# EAGLE design mega16_spg5VonlyV2 (EAGLE 7.3.0)
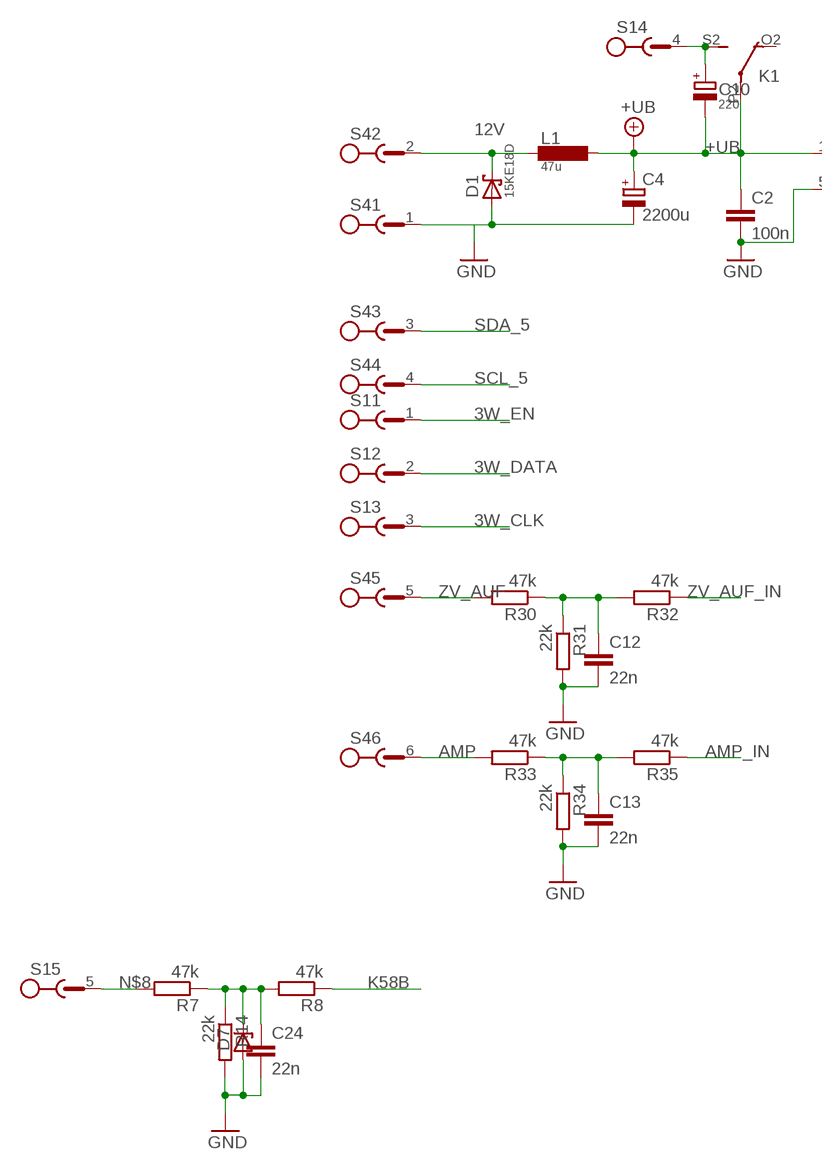
[diagram p0: schematic, sheet 1, part 1 of 2]
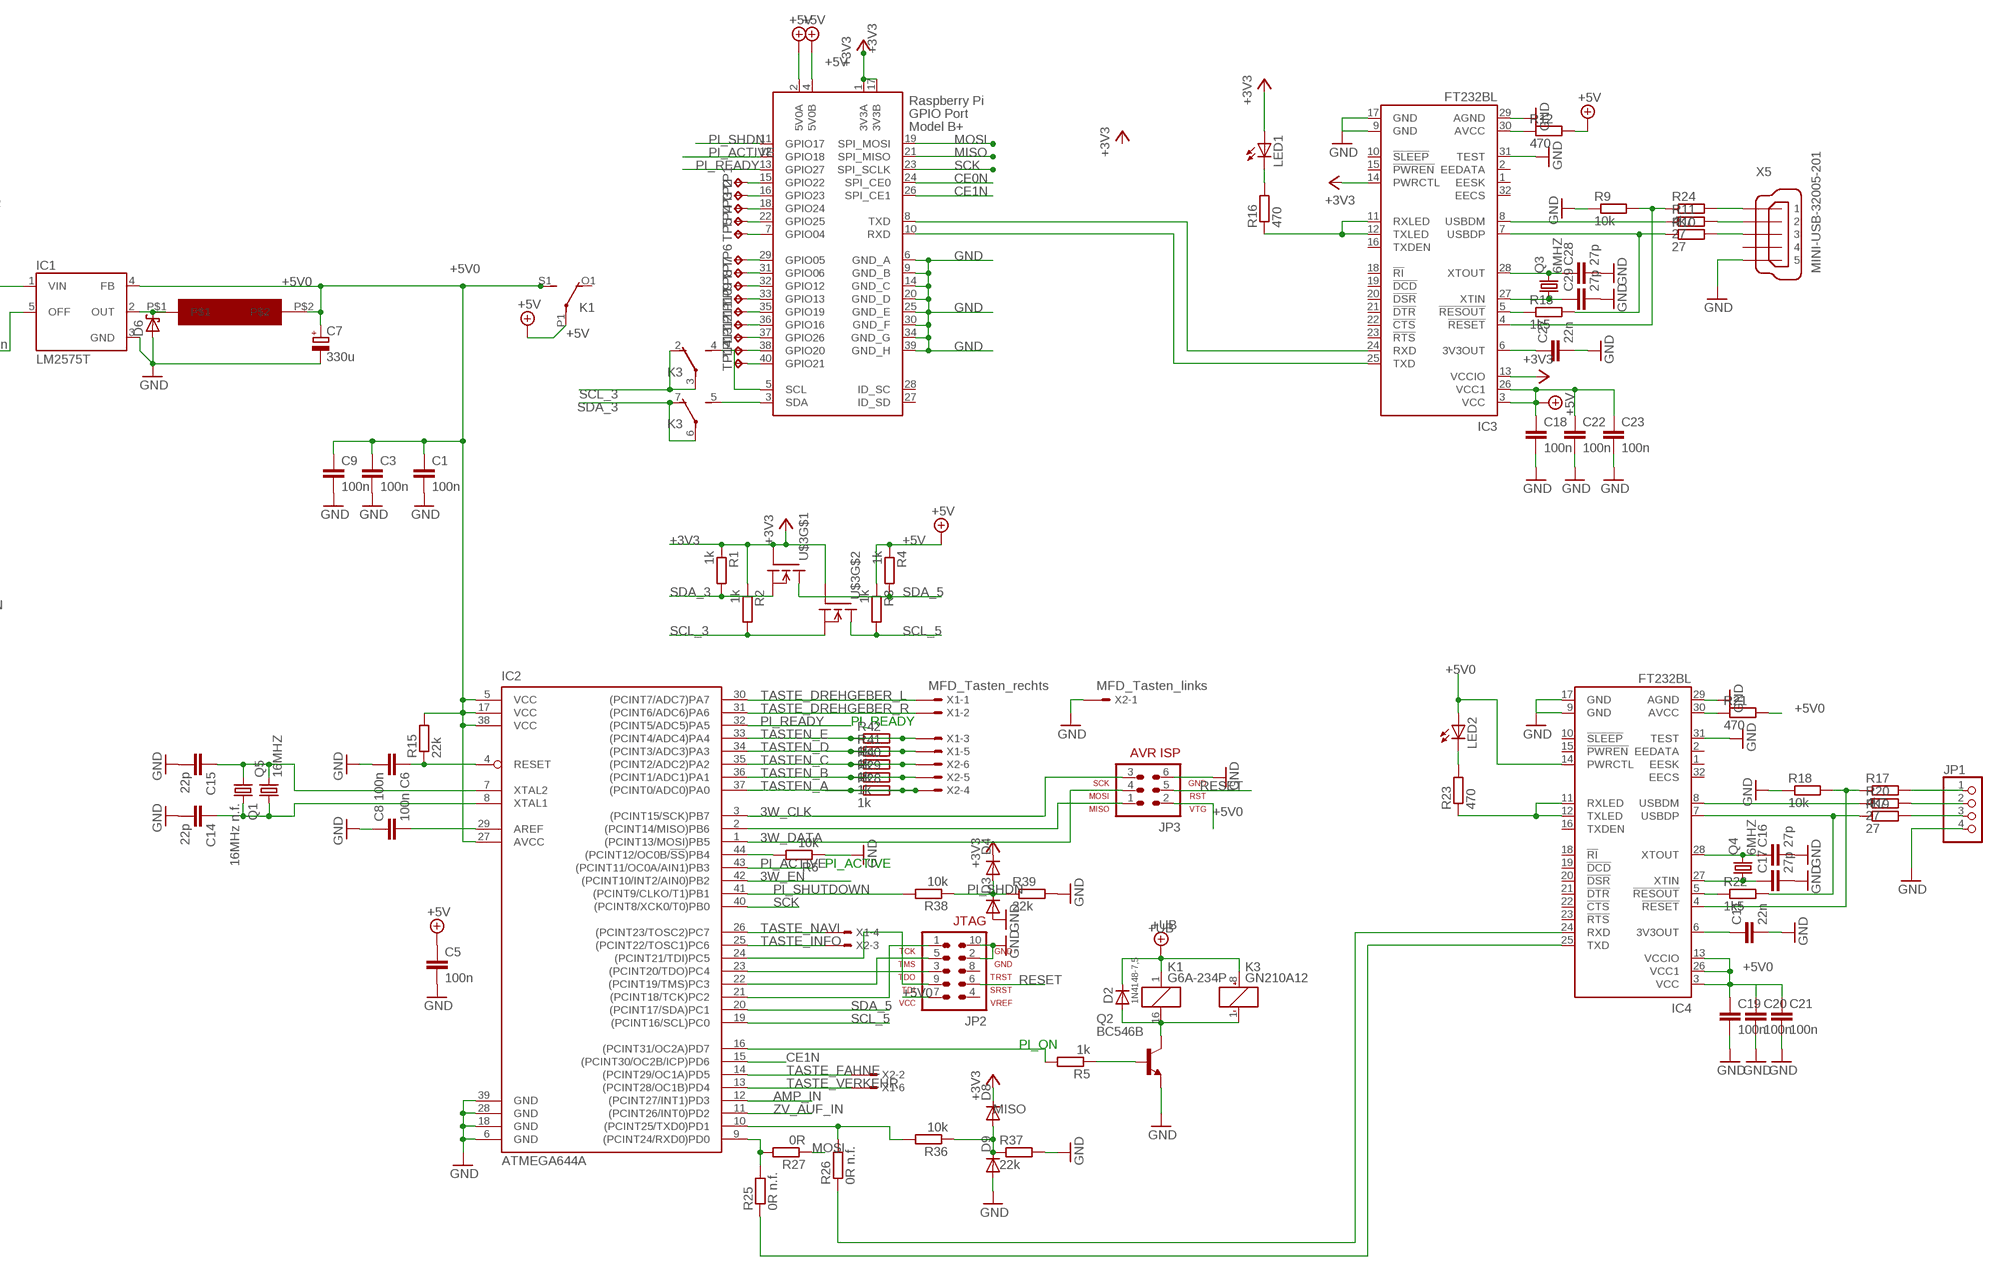
[diagram p1: schematic, sheet 1, part 2 of 2]

## Parts
C1  100n  C-EUC1206  [C1206]
C2  100n  C-EUC1206  [C1206]
C3  100n  C-EUC1206  [C1206]
C4  2200u  CPOL-EUE5-10.5  [E5-10,5]
C5  100n  C-EUC1206  [C1206]
C6  100n  C-EUC1206  [C1206]
C7  330u  CPOL-EUE5-10.5  [E5-10,5]
C8  100n  C-EUC1206  [C1206]
C9  100n  C-EUC1206  [C1206]
C10  220  C_POL_2.5-5  [E2.5-5]
C11  22n  C-EUC1206  [C1206]
C12  22n  C-EUC1206  [C1206]
C13  22n  C-EUC1206  [C1206]
C14  22p  C-EUC1206  [C1206]
C15  22p  C-EUC1206  [C1206]
C16  27p  C-EUC1206  [C1206]
C17  27p  C-EUC1206  [C1206]
C18  100n  C-EUC1206  [C1206]
C19  100n  C-EUC1206  [C1206]
C20  100n  C-EUC1206  [C1206]
C21  100n  C-EUC1206  [C1206]
C22  100n  C-EUC1206  [C1206]
C23  100n  C-EUC1206  [C1206]
C24  22n  C-EUC1206  [C1206]
C27  22n  C-EUC1206  [C1206]
C28  27p  C-EUC1206  [C1206]
C29  27p  C-EUC1206  [C1206]
D1  15KE18D  15KEXXD  [DO201T15]
D2  1N4148-7,5  [DO35-7,5]
D3  DIODE-MICROMELF-W  [MICROMELF-W]
D4  DIODE-MICROMELF-W  [MICROMELF-W]
D6  SCHOTTKY-DIODEF126Z12  [F126Z12]
D7  ZPP-7.5  [DO35-7,5]
D8  DIODE-MICROMELF-W  [MICROMELF-W]
D9  DIODE-MICROMELF-W  [MICROMELF-W]
IC1  LM2575T  [TO220-5]
IC2  ATMEGA644A  [TQFP44]
IC3  FT232BL  [LQFP32-7X7]
IC4  FT232BL  [LQFP32-7X7]
JP1  PINHD-1X4_2.54  [1X04]
JP2  AVR-JTAG-10  [AVR-JTAG-10]
JP3  AVR-ISP-6  [AVR-ISP-6]
K1  G6A-234P  [G6A-234P]
K3  GN210A12  [GN-A]
L1  47u  L-MESC  [MESC26]
LED1  LEDP-LCC-2  [P-LCC-2]
LED2  LEDP-LCC-2  [P-LCC-2]
Q1  16MHz n.f.  CRYSTALHC49S  [HC49/S]
Q2  BC546B  [TO92-EBC]
Q3  6MHZ  CRYSTALCTS406  [CTS406]
Q4  6MHZ  CRYSTALCTS406  [CTS406]
Q5  16MHZ  CRYSTALCTS406  [CTS406]
R1  1k  R-EU_M1206  [M1206]
R2  1k  R-EU_M1206  [M1206]
R3  1k  R-EU_M1206  [M1206]
R4  1k  R-EU_M1206  [M1206]
R5  1k  R-EU_M1206  [M1206]
R6  10k  R-EU_M1206  [M1206]
R7  47k  R-EU_M1206  [M1206]
R8  47k  R-EU_M1206  [M1206]
R9  10k  R-EU_M1206  [M1206]
R10  27  R-EU_M1206  [M1206]
R11  27  R-EU_M1206  [M1206]
R12  470  R-EU_M1206  [M1206]
R13  1k5  R-EU_M1206  [M1206]
R14  22k  R-EU_M1206  [M1206]
R15  22k  R-EU_M1206  [M1206]
R16  470  R-EU_M1206  [M1206]
R17  4k7  R-EU_M1206  [M1206]
R18  10k  R-EU_M1206  [M1206]
R19  27  R-EU_M1206  [M1206]
R20  27  R-EU_M1206  [M1206]
R21  470  R-EU_M1206  [M1206]
R22  1k5  R-EU_M1206  [M1206]
R23  470  R-EU_M1206  [M1206]
R24  4k7  R-EU_M1206  [M1206]
R25  0R n.f.  R-EU_M1206  [M1206]
R26  0R n.f.  R-EU_M1206  [M1206]
R27  0R  R-EU_M1206  [M1206]
R28  1k  R-EU_M1206  [M1206]
R29  1k  R-EU_M1206  [M1206]
R30  47k  R-EU_M1206  [M1206]
R31  22k  R-EU_M1206  [M1206]
R32  47k  R-EU_M1206  [M1206]
R33  47k  R-EU_M1206  [M1206]
R34  22k  R-EU_M1206  [M1206]
R35  47k  R-EU_M1206  [M1206]
R36  10k  R-EU_M1206  [M1206]
R37  22k  R-EU_M1206  [M1206]
R38  10k  R-EU_M1206  [M1206]
R39  22k  R-EU_R1206  [R1206]
R40  1k  R-EU_M1206  [M1206]
R41  1k  R-EU_M1206  [M1206]
R42  1k  R-EU_M1206  [M1206]
S1  CON-RIA-183-05  [RIA-183-05]
S4  CON-RIA-183-06  [RIA-183-06]
TP1  TPPAD1-13  [P1-13]
TP2  TPPAD1-13  [P1-13]
TP3  TPPAD1-13  [P1-13]
TP4  TPPAD1-13  [P1-13]
TP5  TPPAD1-13  [P1-13]
TP6  TPPAD1-13  [P1-13]
TP7  TPPAD1-13  [P1-13]
TP8  TPPAD1-13  [P1-13]
TP9  TPPAD1-13  [P1-13]
TP10  TPPAD1-13  [P1-13]
TP11  TPPAD1-13  [P1-13]
TP12  TPPAD1-13  [P1-13]
TP13  TPPAD1-13  [P1-13]
TP14  TPPAD1-13  [P1-13]
U$1  PISR  [PISR]
U$3  IRF7103  [SO-8]
X1  MFD_Tasten_rechts  057-006-1  [057-006-1]
X2  MFD_Tasten_links  057-006-1  [057-006-1]
X3  RASPI_GPIO_B+#_PIN  [RASPI_GPIO_B+_PIN]
X5  MINI-USB-32005-201  [32005-201]

## Nets
3W_CLK: IC2.3((PCINT15/SCK)PB7) JP3.3 S1.3
3W_DATA: IC2.1((PCINT13/MOSI)PB5) JP3.4 S1.2
3W_EN: IC2.42((PCINT10/INT2/AIN0)PB2) S1.1
12V: D1.C L1.1 S4.2
+3V3: D4.C D8.C IC3.13(VCCIO) IC3.14(PWRCTL) LED1.A R1.1 R2.1 U$3.2(G) U$3.4(G) X3.1(3V3A) X3.17(3V3B)
+5V: C5.1 C18.1 C22.1 C23.1 IC3.3(VCC) IC3.26(VCC1) K1.P1(2:P) R3.1 R4.1 R12.2 X3.2(5V0A) X3.4(5V0B)
+5V0: C1.1 C3.1 C7.+ C9.1 C19.1 C20.1 C21.1 IC1.4(FB) IC2.5(VCC) IC2.17(VCC) IC2.27(AVCC) IC2.38(VCC) IC4.3(VCC) IC4.13(VCCIO) IC4.14(PWRCTL) IC4.26(VCC1) JP2.7 JP3.2 K1.S1(2:S) LED2.A R15.2 R21.2 U$1.P$2
+UB: C2.1 C4.+ C10.- D2.C IC1.1(VIN) K1.1 K1.P2(3:P) K3.8(R:+) L1.2
AMP: R33.2 S4.6
AMP_IN: IC2.12((PCINT27/INT1)PD3) R35.1
CE0N: X3.24(SPI_CE0)
CE1N: IC2.15((PCINT30/OC2B/ICP)PD6) X3.26(SPI_CE1)
GND: C1.2 C2.2 C3.2 C4.- C5.2 C6.2 C7.- C8.1 C9.2 C11.2 C12.2 C13.2 C14.2 C15.2 C16.2 C17.2 C18.2 C19.2 C20.2 C21.2 C22.2 C23.2 C24.2 C27.2 C28.2 C29.2 D1.A D3.A D6.A D7.A D9.A IC1.3(GND) IC1.5(OFF) IC2.6(GND) IC2.18(GND) IC2.28(GND) IC2.39(GND) IC3.9(GND) IC3.17(GND) IC3.29(AGND) IC3.31(TEST) IC4.9(GND) IC4.17(GND) IC4.29(AGND) IC4.31(TEST) JP1.4 JP2.2 JP2.10 JP3.6 Q2.E R6.1 R9.1 R14.2 R18.1 R31.2 R34.2 R37.2 R39.2 S4.1 X2.1 X3.6(GND_A) X3.9(GND_B) X3.14(GND_C) X3.20(GND_D) X3.25(GND_E) X3.30(GND_F) X3.34(GND_G) X3.39(GND_H) X5.5
K58B: R8.1
MISO: D8.A D9.C R36.1 R37.1 X3.21(SPI_MISO)
MOSI: R27.1 X3.19(SPI_MOSI)
N$1: C10.+ K1.S2(3:S) S1.4
N$2: D2.A K1.16 K3.1(R:-) Q2.C
N$3: IC3.24(RXD) X3.8(TXD)
N$4: C24.1 D7.C R7.1 R8.2 R14.1
N$5: D6.C IC1.2(OUT) U$1.P$1
N$6: C15.1 IC2.7(XTAL2) Q1.1 Q5.3
N$7: C8.2 IC2.29(AREF)
N$8: R7.2 S1.5
N$9: IC3.25(TXD) X3.10(RXD)
N$10: IC2.10((PCINT25/TXD0)PD1) R26.2 R36.2
N$11: IC2.21((PCINT18/TCK)PC2) JP2.1
N$12: IC2.22((PCINT19/TMS)PC3) JP2.5
N$13: Q2.B R5.1
N$14: IC2.44((PCINT12/OC0B/!SS!)PB4) R6.2
N$15: IC2.23((PCINT20/TDO)PC4) JP2.3
N$16: IC2.16((PCINT31/OC2A)PD7) R5.2
N$17: IC2.24((PCINT21/TDI)PC5) JP2.9
N$18: C11.1 IC4.6(3V3OUT)
N$19: IC3.11(RXLED) IC3.12(TXLED) R16.1
N$20: IC2.2((PCINT14/MISO)PB6) JP3.1
N$21: LED1.C R16.2
N$22: IC4.7(USBDP) R19.1 R22.2
N$23: IC4.8(USBDM) R20.1
N$24: JP1.1 R17.2
N$25: IC4.4(!RESET) R17.1 R18.2
N$26: JP1.3 R19.2
N$27: JP1.2 R20.2
N$28: IC4.30(AVCC) R21.1
N$29: IC4.5(!RESOUT) R22.1
N$30: C17.1 IC4.27(XTIN) Q4.1
N$31: C16.1 IC4.28(XTOUT) Q4.3
N$32: IC4.24(RXD) R26.1
N$33: IC4.25(TXD) R25.1
N$34: IC4.11(RXLED) IC4.12(TXLED) R23.1
N$35: LED2.C R23.2
N$36: IC2.9((PCINT24/RXD0)PD0) R25.2 R27.2
N$37: K3.5(T:S) X3.3(SDA)
N$38: TP14.1(TP) X3.40(GPIO21)
N$39: K3.4(S:S) X3.5(SCL)
N$40: TP13.1(TP) X3.38(GPIO20)
N$41: TP12.1(TP) X3.37(GPIO26)
N$42: TP11.1(TP) X3.36(GPIO16)
N$43: TP10.1(TP) X3.35(GPIO19)
N$44: TP9.1(TP) X3.33(GPIO13)
N$45: C14.1 IC2.8(XTAL1) Q1.2 Q5.1
N$46: TP8.1(TP) X3.32(GPIO12)
N$47: TP7.1(TP) X3.31(GPIO06)
N$48: TP6.1(TP) X3.29(GPIO05)
N$49: TP1.1(TP) X3.15(GPIO22)
N$50: C12.1 R30.1 R31.1 R32.2
N$51: TP2.1(TP) X3.16(GPIO23)
N$52: C13.1 R33.1 R34.1 R35.2
N$53: TP3.1(TP) X3.18(GPIO24)
N$54: R10.2 X5.3
N$55: R11.2 X5.2
N$56: IC3.30(AVCC) R12.1
N$57: IC3.5(!RESOUT) R13.1
N$58: C27.1 IC3.6(3V3OUT)
N$59: IC3.7(USBDP) R10.1 R13.2
N$60: IC3.8(USBDM) R11.1
N$61: R24.2 X5.1
N$62: IC3.4(!RESET) R9.2 R24.1
N$63: C29.1 IC3.27(XTIN) Q3.1
N$64: C28.1 IC3.28(XTOUT) Q3.3
N$65: TP4.1(TP) X3.22(GPIO25)
N$66: TP5.1(TP) X3.7(GPIO04)
PI_ACTIVE: IC2.43((PCINT11/OC0A/AIN1)PB3) X3.12(GPIO18)
PI_READY: IC2.32((PCINT5/ADC5)PA5) X3.13(GPIO27)
PI_SHDN: D3.C D4.A R38.1 R39.1 X3.11(GPIO17)
PI_SHUTDOWN: IC2.41((PCINT9/CLKO/T1)PB1) R38.2
RESET: C6.1 IC2.4(RESET) JP2.6 JP3.5 R15.1
SCK: IC2.40((PCINT8/XCK0/T0)PB0) X3.23(SPI_SCLK)
SCL_3: K3.2(S:O) K3.3(S:P) R2.2 U$3.3(S)
SCL_5: IC2.19((PCINT16/SCL)PC0) R3.2 S4.4 U$3.5(D1) U$3.6(D)
SDA_3: K3.6(T:P) K3.7(T:O) R1.2 U$3.1(S)
SDA_5: IC2.20((PCINT17/SDA)PC1) R4.2 S4.3 U$3.7(D) U$3.8(D1)
TASTE_DREHGEBER_L: IC2.30((PCINT7/ADC7)PA7) X1.1
TASTE_DREHGEBER_R: IC2.31((PCINT6/ADC6)PA6) X1.2
TASTE_FAHNE: IC2.14((PCINT29/OC1A)PD5) X2.2
TASTE_INFO: IC2.25((PCINT22/TOSC1)PC6) X2.3
TASTE_NAVI: IC2.26((PCINT23/TOSC2)PC7) X1.4
TASTE_VERKEHR: IC2.13((PCINT28/OC1B)PD4) X1.6
TASTEN_A: IC2.37((PCINT0/ADC0)PA0) R28.1 R28.2 X2.4
TASTEN_B: IC2.36((PCINT1/ADC1)PA1) R29.1 R29.2 X2.5
TASTEN_C: IC2.35((PCINT2/ADC2)PA2) R40.1 R40.2 X2.6
TASTEN_D: IC2.34((PCINT3/ADC3)PA3) R41.1 R41.2 X1.5
TASTEN_E: IC2.33((PCINT4/ADC4)PA4) R42.1 R42.2 X1.3
ZV_AUF: R30.2 S4.5
ZV_AUF_IN: IC2.11((PCINT26/INT0)PD2) R32.1
Unconnected: IC3.1(EESK) IC3.2(EEDATA) IC3.10(!SLEEP) IC3.15(!PWREN) IC3.16(TXDEN) IC3.18(!RI) IC3.19(!DCD) IC3.20(!DSR) IC3.21(!DTR) IC3.22(!CTS) IC3.23(!RTS) IC3.32(EECS) IC4.1(EESK) IC4.2(EEDATA) IC4.10(!SLEEP) IC4.15(!PWREN) IC4.16(TXDEN) IC4.18(!RI) IC4.19(!DCD) IC4.20(!DSR) IC4.21(!DTR) IC4.22(!CTS) IC4.23(!RTS) IC4.32(EECS) JP2.4 JP2.8 K1.O1(2:O) K1.O2(3:O) X3.27(ID_SD) X3.28(ID_SC) X5.4

## Notes on the sheet
- PI_READY
- PI_ACTIVE
- PI_ON

## Library data of the parts
C1-C3 C5 C6 C8 C9 C11-C24 C27-C29 = rcl:C-EU: CAPACITOR, European symbol
C4 C7 = rcl:CPOL-EU: POLARIZED CAPACITOR, European symbol
C10 = 0_eigene:C_POL_2.5-5
D1 = 0_eigene:15KEXXD: DIODE
D2 = 0_eigene:1N4148-7,5
D3 D4 D8 D9 = diode:DIODE-: DIODE
D6 = diode:SCHOTTKY-DIODE: Schottky Diode
D7 = 0_eigene:ZPP-7.5
IC1 = v-reg-3:LM2575: National Semiconductor <http://www.national.com> 1.0A "Simple Switcher"(c) 52kHz, Vout 1.23-37V (HV: 57V), Vin 40V (HV: 60V), 50µA standby current
IC2 = atmel:ATMEGA644: 8-bit Microcontroller with 64K Bytes In-System Programmable Flash Source: http://www.atmel.com/dyn/resources/prod_documents/doc2593.pdf
IC3 IC4 = ftdichip:FT232B: USB to serial UART interface Source: DS_FT232BL_BQ.pdf; MF: FARNELL; MPN: FT232BL/TR; OC_FARNELL: unknown; OC_NEWARK: 38K1551
JP1 = pinhead:PINHD-1X4: PIN HEADER
JP2 = avr-5:AVR-JTAG-10: AVR JTAG Debug/Programming Header
JP3 = avr-5:AVR-ISP-6: AVR ISP-6 Serial Programming Header
K1 = relay:G6A-234P: RELAY 2 x switch, 0.3 A/125 V AC, 1 A/30 V DC, Omron
K3 = relay:GN?*: ULTRA-SMALL PACKAGE SLIM POLARIZED RELAY NAiS Source: http://www.mew-europe.com/.. en_ds_61007_0000.pdf
L1 = 0_eigene:L-MESC
LED1 LED2 = led:LED: LED OSRAM: - CHIPLED LG R971, LG N971, LY N971, LG Q971, LY Q971, LO R971, LY R971 LH N974, LH R974 LS Q976, LO Q976, LY Q976 LO Q996 - Hyper CHIPLED LW Q18S LB Q993, LB Q99A, LB R99A - SideLED LS A670, LO A670, LY A670, LG A670, LP A670 LB A673, LV A673, LT A673, LW A673 LH A674 LY A675 LS A676, LA A676, LO A676, LY A676, LW A676 LS A679, LY A679, LG A679 - Hyper Micro SIDELED® LS Y876, LA Y876, LO Y876, LY Y876 LT Y87S - SmartLED LW L88C, LW L88S LB L89C, LB L89S, LG L890 LS L89K, LO L89K, LY L89K LS L896, LA L896, LO L896, LY L896 - TOPLED LS T670, LO T670, LY T670, LG T670, LP T670 LSG T670, LSP T670, LSY T670, LOP T670, LYG T670 LG T671, LOG T671, LSG T671 LB T673, LV T673, LT T673, LW T673 LH T674 LS T676, LA T676, LO T676, LY T676, LB T676, LH T676, LSB T676, LW T676 LB T67C, LV T67C, LT T67C, LS T67K, LO T67K, LY T67K, LW E67C LS E67B, LA E67B, LO E67B, LY E67B, LB E67C, LV E67C, LT E67C LW T67C LS T679, LY T679, LG T679 LS T770, LO T770, LY T770, LG T770, LP T770 LB T773, LV T773, LT T773, LW T773 LH T774 LS E675, LA E675, LY E675, LS T675 LS T776, LA T776, LO T776, LY T776, LB T776 LHGB T686 LT T68C, LB T68C - Hyper Mini TOPLED® LB M676 - Mini TOPLED Santana® LG M470 LS M47K, LO M47K, LY M47K Source: http://www.osram.convergy.de LUXEON: - LUMILED® LXK2-PW12-R00, LXK2-PW12-S00, LXK2-PW14-U00, LXK2-PW14-V00 LXK2-PM12-R00, LXK2-PM12-S00, LXK2-PM14-U00 LXK2-PE12-Q00, LXK2-PE12-R00, LXK2-PE12-S00, LXK2-PE14-T00, LXK2-PE14-U00 LXK2-PB12-K00, LXK2-PB12-L00, LXK2-PB12-M00, LXK2-PB14-N00, LXK2-PB14-P00, LXK2-PB14-Q00 LXK2-PR12-L00, LXK2-PR12-M00, LXK2-PR14-Q00, LXK2-PR14-R00 LXK2-PD12-Q00, LXK2-PD12-R00, LXK2-PD12-S00 LXK2-PH12-R00, LXK2-PH12-S00 LXK2-PL12-P00, LXK2-PL12-Q00, LXK2-PL12-R00 Source: www.luxeon.com KINGBRIGHT: KA-3528ASYC Source: www.kingbright.com
Q1 Q3-Q5 = crystal:CRYSTAL: CRYSTAL
Q2 = transistor-npn:BC546*: NPN Transistor
R1-R42 = rcl:R-EU_: RESISTOR, European symbol
S1 = 0_eigene:CON-RIA-183-05
S4 = 0_eigene:CON-RIA-183-06
TP1-TP14 = testpad:TP: Test pad
U$1 = inductor_FASTRON:PISR
U$3 = transistor-fet+irf7201:IRF7103
X1 X2 = con-panduit:057-006-: CONNECTOR 6-pin series 057 contact pc board low profile headers
X3 = raspberrypi_bastelstube_v13:RASPI_GPIO_B+#: 2x20 header connector, all pins connected
X5 = con-cypressindustries:MINI-USB-: MINI USB-B Conector Source: www.cypressindustries.com

## Board
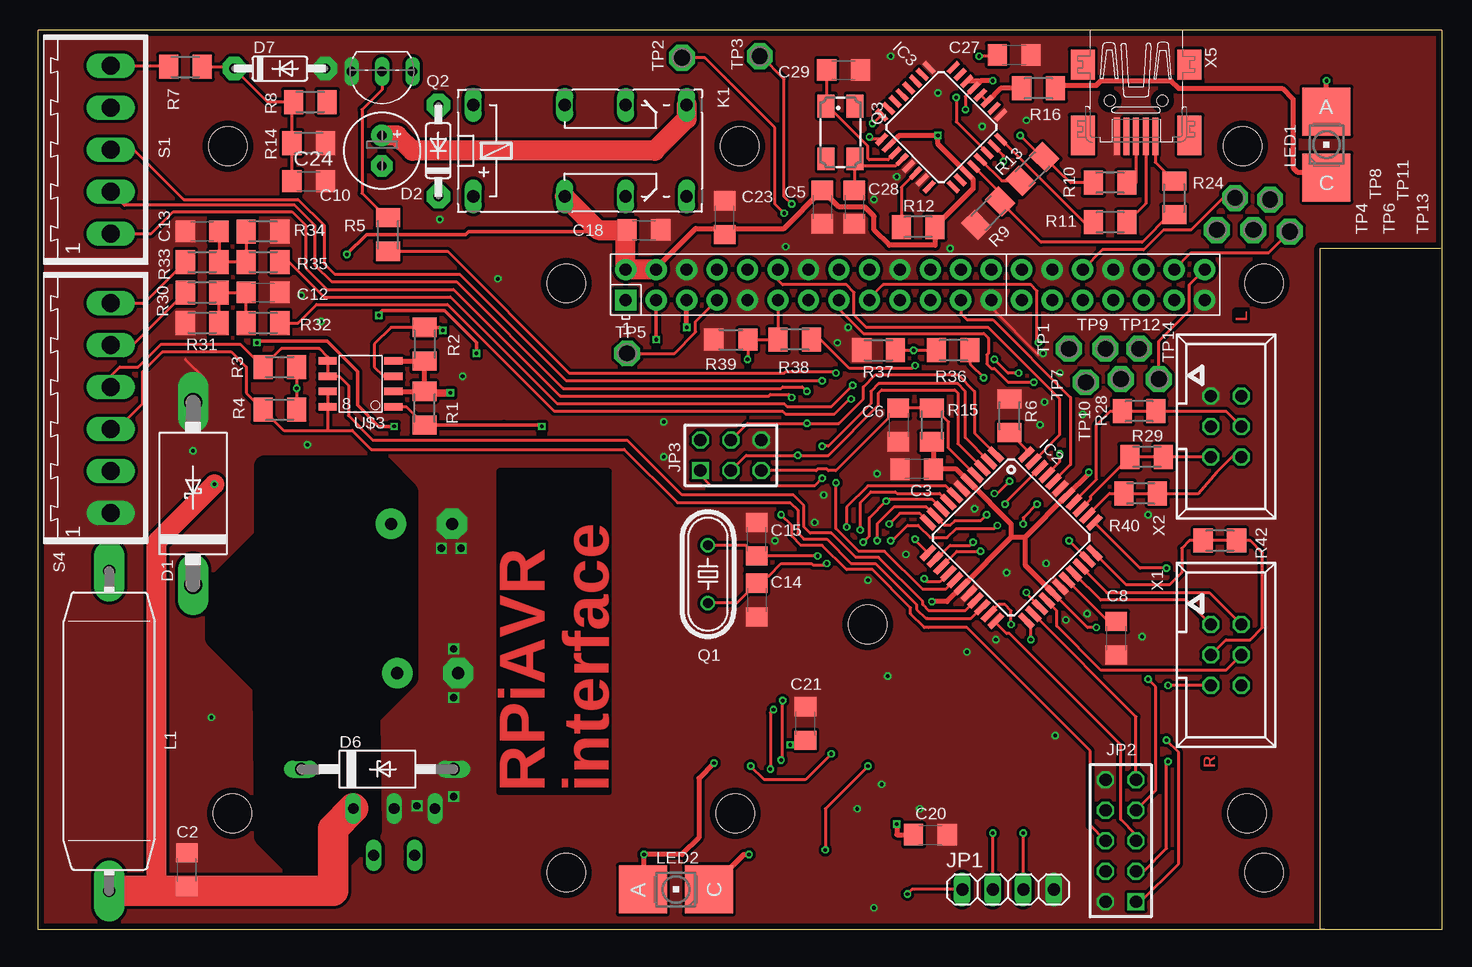
[diagram p2: board, top side]
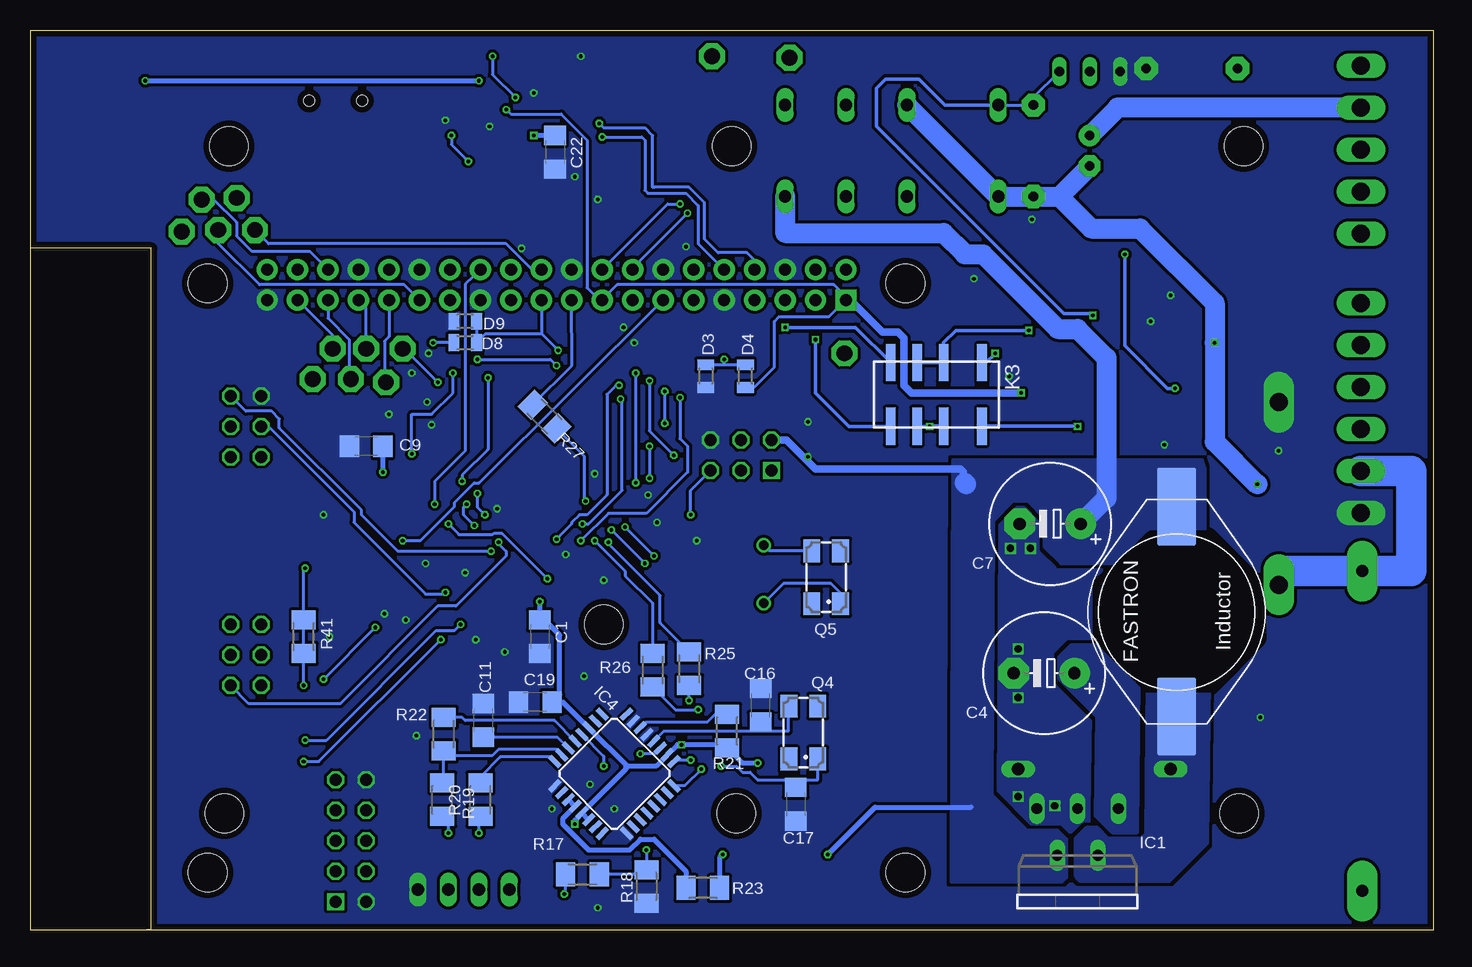
[diagram p3: board, bottom side, seen from below]

Size 117 x 75 mm. Coordinates in mm from the lower left corner, seen from the top.
Outline: 107.27,0.04 106.89,0.04 106.89,56.8 116.92,56.8
Copper layers (1*16): Top 0.035mm / dielectric 1.5mm / Bottom 0.035mm
Design rules "Aetzwerk-DRC 2 Lagen 35µm Cu *": minimum track width 6mil, minimum drill 12mil, track to track 6mil, track to pad 6mil, pad to pad 6mil, via to via 6mil, smd to smd 6mil, copper to edge 20mil, drill to drill 8mil, minimum pad ring 8mil, minimum via ring 6mil, stop-mask expansion 3mil, vias tented up to drill 12mil, thermal gap 8mil
Holes 3.2 mm at 44.02,4.73 102.19,4.73 102.19,53.88 44.02,53.88
tRestrict: area 14.8,4.5 to 30.8,38.6
bRestrict: area 14.8,20.4 to 27.5,32.7

### Footprints (pad centres in the part's own frame; a part is rotated, then mirrored left to right if it is on the bottom)
C1206 = smd 1.6 x 1.8: 1 -1.4,0; 2 1.4,0
E5-10,5 = drill 1.016 pad 2.54: + -2.54,0 | drill 1.016 pad 2.54 octagon: - 2.54,0
E2.5-5 = drill 0.8 pad 1.778: + -1.27,0 | drill 0.8 pad 1.778 octagon: - 1.27,0
DO201T15 = drill 1.5 pad 2.54 long: A 7.62,0; C -7.62,0
DO35-7,5 = drill 0.8 pad 1.93 octagon: A 3.81,0; C -3.81,0
MICROMELF-W = smd 0.9 x 1.4: A 0.95,0; C -0.95,0
F126Z12 = drill 1.016 long: A 6.35,0; C -6.35,0
TO220-5 = drill 0.9 long: 1 -3.4,-8.4; 2 -1.7,-4.5; 3 0,-8.4; 4 1.7,-4.5; 5 3.4,-8.4
TQFP44 = smd 1.5 x 0.5: 1 -5.8,4; 2 -5.8,3.2; 3 -5.8,2.4; 4 -5.8,1.6; 5 -5.8,0.8; 6 -5.8,0; 7 -5.8,-0.8; 8 -5.8,-1.6; 9 -5.8,-2.4; 10 -5.8,-3.2; 11 -5.8,-4; 23 5.8,-4; 24 5.8,-3.2; 25 5.8,-2.4; 26 5.8,-1.6; 27 5.8,-0.8; 28 5.8,0; 29 5.8,0.8; 30 5.8,1.6; 31 5.8,2.4; 32 5.8,3.2; 33 5.8,4 | smd 0.5 x 1.5: 12 -4,-5.8; 13 -3.2,-5.8; 14 -2.4,-5.8; 15 -1.6,-5.8; 16 -0.8,-5.8; 17 0,-5.8; 18 0.8,-5.8; 19 1.6,-5.8; 20 2.4,-5.8; 21 3.2,-5.8; 22 4,-5.8; 34 4,5.8; 35 3.2,5.8; 36 2.4,5.8; 37 1.6,5.8; 38 0.8,5.8; 39 0,5.8; 40 -0.8,5.8; 41 -1.6,5.8; 42 -2.4,5.8; 43 -3.2,5.8; 44 -4,5.8
LQFP32-7X7 = smd 1.2 x 0.4: 1 -4.225,2.8; 2 -4.225,2; 3 -4.225,1.2; 4 -4.225,0.4; 5 -4.225,-0.4; 6 -4.225,-1.2; 7 -4.225,-2; 8 -4.225,-2.8; 17 4.225,-2.8; 18 4.225,-2; 19 4.225,-1.2; 20 4.225,-0.4; 21 4.225,0.4; 22 4.225,1.2; 23 4.225,2; 24 4.225,2.8 | smd 0.4 x 1.2: 9 -2.8,-4.225; 10 -2,-4.225; 11 -1.2,-4.225; 12 -0.4,-4.225; 13 0.4,-4.225; 14 1.2,-4.225; 15 2,-4.225; 16 2.8,-4.225; 25 2.8,4.225; 26 2,4.225; 27 1.2,4.225; 28 0.4,4.225; 29 -0.4,4.225; 30 -1.2,4.225; 31 -2,4.225; 32 -2.8,4.225
1X04 = drill 1.016 long: 1 -3.81,0; 2 -1.27,0; 3 1.27,0; 4 3.81,0
AVR-JTAG-10 = drill 1.016 square: 1 -5.08,-1.27 | drill 1.016 octagon: 2 -5.08,1.27; 3 -2.54,-1.27; 4 -2.54,1.27; 5 0,-1.27; 6 0,1.27; 7 2.54,-1.27; 8 2.54,1.27; 9 5.08,-1.27; 10 5.08,1.27
AVR-ISP-6 = drill 1.016 square: 1 -2.54,-1.27 | drill 1.016 octagon: 2 -2.54,1.27; 3 0,-1.27; 4 0,1.27; 5 2.54,-1.27; 6 2.54,1.27
G6A-234P = drill 1.016 long: 1 -3.81,-3.81; 16 -3.81,3.81; O1 8.89,-3.81; O2 8.89,3.81; P1 3.81,-3.81; P2 3.81,3.81; S1 13.97,-3.81; S2 13.97,3.81
GN-A = smd 0.8 x 3.1: 1 -3.835,-2.65; 2 -0.635,-2.65; 3 1.565,-2.65; 4 3.765,-2.65; 5 3.765,2.65; 6 1.565,2.65; 7 -0.635,2.65; 8 -3.835,2.65
MESC26 = drill 1 pad 2.54 long: 1 -13.335,0; 2 13.335,0
P-LCC-2 = smd 4 x 4: A 0,2.75; C 0,-2.75
HC49/S = drill 0.813: 1 -2.413,0; 2 2.413,0
TO92-EBC = drill 0.813 long: B 0,-1.27; C -2.54,-1.27; E 2.54,-1.27
CTS406 = smd 1.9 x 1.4: 1 -2.2,-1.2; 2 2.2,-1.2; 3 2.2,1.2; 4 -2.2,1.2
M1206 = smd 1.6 x 2: 1 -1.4,0; 2 1.4,0
R1206 = smd 1.6 x 1.803: 1 -1.422,0; 2 1.422,0
RIA-183-05 = drill 1.5 pad 2.032 long: 1 -5.25,0; 2 -1.75,0; 3 1.75,0; 4 5.25,0; 5 8.75,0
RIA-183-06 = drill 1.5 pad 2.032 long: 1 -8.75,0; 2 -5.25,0; 3 -1.75,0; 4 1.75,0; 5 5.25,0; 6 8.75,0
P1-13 = drill 1.321 pad 2.159 octagon: 1 0,0
PISR = smd 6.452 x 3.251: P$1 -8.7,0; P$2 8.8,0
EUROBOX = hole 3.2: -42.291,-27.813; -0.381,-27.813; 42.291,-27.813; 41.91,27.813; 0,27.813; -42.672,27.813; 10.668,-12.065
SO-8 = smd 1.524 x 0.61: 1 -2.743,1.27; 2 -2.743,0; 3 -2.743,-1.27; 4 -2.743,-2.54; 5 2.743,-2.54; 6 2.743,-1.27; 7 2.743,0; 8 2.743,1.27
057-006-1 = drill 1 octagon: 1 -2.54,-1.27; 2 -2.54,1.27; 3 0,-1.27; 4 0,1.27; 5 2.54,-1.27; 6 2.54,1.27
RASPI_GPIO_B+_PIN = drill 1 pad 1.778 square: 1 -24.13,-1.27 | drill 1 pad 1.778: 2 -24.13,1.27; 3 -21.59,-1.27; 4 -21.59,1.27; 5 -19.05,-1.27; 6 -19.05,1.27; 7 -16.51,-1.27; 8 -16.51,1.27; 9 -13.97,-1.27; 10 -13.97,1.27; 11 -11.43,-1.27; 12 -11.43,1.27; 13 -8.89,-1.27; 14 -8.89,1.27; 15 -6.35,-1.27; 16 -6.35,1.27; 17 -3.81,-1.27; 18 -3.81,1.27; 19 -1.27,-1.27; 20 -1.27,1.27; 21 1.27,-1.27; 22 1.27,1.27; 23 3.81,-1.27; 24 3.81,1.27; 25 6.35,-1.27; 26 6.35,1.27; 27 8.89,-1.27; 28 8.89,1.27; 29 11.43,-1.27; 30 11.43,1.27; 31 13.97,-1.27; 32 13.97,1.27; 33 16.51,-1.27; 34 16.51,1.27; 35 19.05,-1.27; 36 19.05,1.27; 37 21.59,-1.27; 38 21.59,1.27; 39 24.13,-1.27; 40 24.13,1.27
32005-201 = smd 3.1 x 0.5: 1 3,1.6; 2 3,0.8; 3 3,0; 4 3,-0.8; 5 3,-1.6 | smd 2.5 x 2: M1 -3,-4.45; M2 -3,4.45 | smd 3.3 x 2: M3 2.9,4.45; M4 2.9,-4.45 | hole 0.9: 0,2.2; 0,-2.2

### Placement (x,y rotation side)
C1  74.5,24.42 270 bottom
C2  12.4,4.99 90 top
C3  73.23,38.39 180 top
C4  32.46,21.37 180 bottom
C5  65.36,60.23 270 top
C6  71.71,42.07 270 top
C7  31.96,33.82 180 bottom
C8  89.87,24.29 90 top
C9  88.98,40.29 180 bottom
C10  28.65,64.93 270 top
C11  79.2,17.43 90 bottom
C12  18.75,53.12 0 top
C13  13.67,58.2 180 top
C14  59.9,27.47 270 top
C15  59.9,32.55 90 top
C16  56.09,18.7 90 bottom
C17  53.17,10.45 270 bottom
C18  50.5,58.33 0 top
C19  74.88,18.96 180 bottom
C20  74.38,7.91 0 top
C21  63.96,17.18 90 top
C22  73.23,64.81 270 bottom
C23  57.23,59.34 90 top
C24  22.56,62.39 0 top
C27  81.36,72.93 0 top
C28  68.03,60.23 270 top
C29  67.14,71.66 0 top
D1  12.91,36.36 90 top
D2  33.35,64.93 90 top
D3  60.66,46.14 270 bottom
D4  57.36,46.14 90 bottom
D6  28.27,13.37 0 top
D7  20.15,71.79 0 top
D8  80.72,48.93 0 bottom
D9  80.72,50.71 180 bottom
IC1  29.67,1.69 180 bottom
IC2  81.11,32.67 315 top
IC3  75.28,66.9 135 top
IC4  68.28,12.99 315 bottom
JP1  80.85,3.34 0 top
JP2  90.25,7.4 90 top
JP3  57.74,39.53 0 top
K1  40.08,64.93 0 top
K3  41.48,44.61 180 bottom
L1  5.92,16.55 270 top
LED1  107.39,65.44 0 top
LED2  53.17,3.34 90 top
Q1  55.83,29.63 270 top
Q2  28.65,70.27 180 top
Q3  66.88,66.46 270 top
Q4  52.53,16.42 90 bottom
Q5  50.63,29.37 90 bottom
R1  32.21,43.47 270 top
R2  32.21,48.8 90 top
R3  20.15,46.9 180 top
R4  20.15,43.34 180 top
R5  29.16,57.95 270 top
R6  80.98,42.83 270 top
R7  12.27,71.92 180 top
R8  22.69,69 180 top
R9  79.2,59.73 45 top
R10  89.36,62.27 0 top
R11  89.36,58.96 0 top
R12  73.36,58.58 0 top
R13  82.88,63.41 45 top
R14  22.56,65.57 0 top
R15  74.5,42.07 270 top
R16  83.39,70.14 0 top
R17  70.95,4.61 180 bottom
R18  65.61,3.59 90 bottom
R19  82.63,10.83 270 bottom
R20  79.45,10.83 270 bottom
R21  58.88,16.55 270 bottom
R22  82.5,16.29 270 bottom
R23  60.91,3.46 0 bottom
R24  94.69,61 90 top
R25  62.06,21.75 90 bottom
R26  65.1,21.62 90 bottom
R27  74.11,42.77 315 bottom
R28  91.77,43.22 0 top
R29  92.41,39.41 0 top
R30  13.67,53.12 180 top
R31  13.67,50.58 180 top
R32  18.75,50.58 180 top
R33  13.67,55.66 180 top
R34  18.75,58.2 0 top
R35  18.75,55.66 180 top
R36  76.28,48.3 0 top
R37  70.06,48.3 180 top
R38  63.07,49.18 0 top
R39  57.74,49.18 180 top
R40  91.9,36.36 0 top
R41  94.19,24.42 270 bottom
R42  98.5,32.42 0 top
S1  6.05,63.28 90 top
S4  6.05,43.47 90 top
TP1  85.93,48.42 0 top
TP2  53.67,72.68 0 top
TP3  60.15,72.81 0 top
TP4  98.25,58.33 0 top
TP5  49.1,48.04 0 top
TP6  101.3,58.33 0 top
TP7  87.33,45.63 0 top
TP8  99.77,61 0 top
TP9  88.98,48.42 0 top
TP10  90.25,45.88 0 top
TP11  102.7,60.87 0 top
TP12  91.77,48.42 0 top
TP13  104.35,58.2 0 top
TP14  93.42,45.88 0 top
U$1  21.42,26.45 90 bottom
U$2  [EUROBOX]  58.5,37.5 0 top
U$3  26.88,44.87 180 top
X1  99.01,22.89 270 top
X2  99.01,41.95 270 top
X3  73.11,53.76 0 top
X5  91.52,69.12 270 top

### Tracks (layer width: path | path; a pad name or v marks a point on that pad's centre or on a via)
3W_CLK  (via drill 0.3)
  Top 0.254: S1.3 7.98,65.03 12.14,60.87 21.67,60.87 23.83,58.71 23.83,55.53 24.72,54.65 35.13,54.65 44.02,45.76 v65.36,45.76 | JP3.3 59.01,39.53 v63.33,39.53 65.87,39.53 70.06,43.72 70.06,44.74 70.31,44.99 76.41,44.99 76.66,44.74 76.66,40.51 IC2.3
  Bottom 0.254: v65.36,45.76 65.36,41.56 v63.33,39.53
3W_DATA  (via drill 0.3)
  Top 0.254: v64.09,44.87 63.71,45.25 62.06,45.25 61.93,45.12 43.77,45.12 34.88,54.01 24.46,54.01 23.07,55.41 23.07,58.71 21.39,60.39 7.19,60.39 S1.2 | JP3.4 59.13,42.2 v64.09,42.2 66.75,42.2 68.79,44.23 68.79,45.25 69.8,46.26 76.66,46.26 78.06,44.87 78.06,41.38 IC2.1
  Bottom 0.254: v64.09,44.87 v64.09,42.2
3W_EN  (via drill 0.3)
  Top 0.254: S1.1 9.43,58.03 11.26,59.85 21.16,59.85 22.3,58.71 22.3,55.15 24.08,53.38 34.62,53.38 43.51,44.48 60.91,44.48 61.04,44.61 62.56,44.61 v62.82,44.36 | v71.07,32.42 71.2,32.42 72.47,33.69 73.36,33.69 74.38,32.67 75.77,32.67 76.53,33.44 79.71,33.44 v79.96,33.69 | v80.6,35.47 80.6,35.56 IC2.42
  Bottom 0.254: v62.82,44.36 62.82,40.93 62.18,40.29 62.18,38.13 65.61,34.71 68.79,34.71 v71.07,32.42 | v79.96,33.69 80.85,34.58 80.85,35.21 v80.6,35.47
12V
  Bottom 2.54: S4.2 1.86,38.22 1.86,29.88 L1.1 12.91,29.88 D1.C
+3V3  (via drill 0.3)
  Top 0.254: IC3.13 77.3,69.48 v77.3,68.36 | R1.1 | R2.1 | v83.39,48.93 83.27,49.06 83.27,53.25 82.76,53.76 70.44,53.76 69.29,52.61 X3.17
  Top 0.406: LED1.A v107.39,70.77 | v79.58,70.77 78.59,70.77 | 78.59,70.77 IC3.13 | IC3.14 77.46,70.77 78.59,70.77 | U$3.2 R1.1 | R1.1 R2.1 | U$3.4 R2.1
  Top 0.61: v34.37,44.74 32.34,44.74 R1.1
  Bottom 0.254: v77.3,68.36 76.91,67.98 72.72,67.98 70.56,65.82 70.56,53.5 69.6,52.54 X3.17 68.06,53.76 49.99,53.76 48.96,52.73 X3.1 50.41,51.09 54.56,51.09 54.94,50.71 54.94,46.9 56.59,45.25 57.3,45.25 D4.C 57.8,45.19 | D8.C v83.39,48.93
  Bottom 0.406: v107.39,70.77 v79.58,70.77
  Bottom 0.61: X3.1 48.64,52.54 45.93,49.82 44.66,49.82 44.15,49.31 44.15,45.37 43.51,44.74 v34.37,44.74
+5V  (via drill 0.3)
  Top 0.254: R12.2 | R3.1 21.55,44.99 R4.1 | C18.1 48.97,58.33
  Top 0.305: 48.97,58.2 35.89,58.2 35.64,57.95 27.38,57.95 v25.73,56.3 | v21.54,45.12 21.54,45 21.55,44.99
  Top 0.406: IC3.26 71.76,66.2 v75.01,66.2 75.01,65.47 IC3.3 77.93,62.55 77.93,61.76 R12.2 | X3.4 51.5,55.14 54.82,58.45 57.36,58.45 | 57.36,58.45 62.18,58.45 C5.1 66.76,60.23 68.91,60.23 69.67,59.47 69.67,58.33 70.95,57.06 | R12.2 74.76,57.06 70.95,57.06 | C23.1 57.36,58.07 57.36,58.45 | 70.94,57.06 70.95,57.06
  Top 1.676: X3.4 X3.2 48.96,58.19 48.97,58.2 48.97,58.33 46.69,58.33 K1.P1
  Bottom 0.305: v25.73,56.3 25.73,48.68 22.18,45.12 v21.54,45.12
  Bottom 0.406: C22.1 v75.01,66.2
+5V0  (via drill 0.3)
  Top 0.254: JP2.7 93.17,11.59 93.17,20.23 v92.54,20.86 | v88.22,25.18 87.47,25.18 IC2.27
  Top 0.406: 82.31,32.74 IC2.38 87.58,38.02 v87.58,38.13 | 82.31,32.74 82.24,32.67 81.11,32.67 | 81.11,32.67 IC2.17 75.77,27.34 v74.5,27.34 | IC2.27 82.31,30.34 82.31,32.74 | 81.11,32.67 81.11,33.8 IC2.5 76.52,38.39 C3.1 74.63,40.54 R15.2 | LED2.A 50.5,3.42 v50.5,6.26 53.67,6.26 55.07,7.66 55.07,12.61 v56.34,13.88 | v71.58,8.8 71.58,7.91 C20.1 | C21.1 63.58,15.4 v62.69,15.4
  Bottom 0.254: v92.54,20.86 v88.22,25.18
  Bottom 0.406: v87.58,38.13 v87.58,38.14 C9.1 | v74.5,27.34 C1.1 74.12,25.82 72.85,24.55 72.85,19.59 C19.1 72.55,18.96 IC4.3 67.3,13.71 | 67.3,13.71 67.22,13.62 64.82,13.62 IC4.26 63.04,15.4 v62.69,15.4 59.14,15.4 R21.2 57.61,13.88 v56.34,13.88 | IC4.13 67.3,13.4 67.3,13.71 | IC4.14 IC4.13 | v50.5,6.26 46.56,10.2 38.56,10.2 | IC4.13 71.58,9.12 v71.58,8.8
  Bottom 0.61: JP3.2 53.93,40.8 51.52,38.39 39.45,38.39 39.2,38.13
  Bottom 1.676: K1.S1 54.05,58.07 40.85,58.07 39.07,56.3 37.55,56.3 31.32,50.07 29.67,50.07 27.26,47.66 27.26,35.98 C7.+ | 39.07,37.25 38.94,37.12
  pour Bottom (rank 2, no thermals): 19.26,39.15 40.08,39.15 40.21,3.97 30.94,3.97 30.56,4.35 30.56,7.53 31.32,8.29 33.86,8.29 36.78,11.21 36.66,33.56 36.66,34.07 35,35.72 33.86,35.72 32.46,34.33 32.46,31.91 31.07,30.52 20.65,30.52 19,32.17 19,38.39
+UB  (via drill 0.3)
  Top 0.254: 11,3.34 11,3.21 | C2.1 12.4,3.21
  Top 0.305: v29.67,41.95 28.4,41.95 26.62,43.72 26.62,46.52 24.08,49.06 18.37,49.06 v18.24,48.93
  Top 1.676: v14.68,37.12 9.99,32.42 9.86,32.17 9.86,3.34 9.99,3.21
  Top 2.54: L1.2 9.99,3.21 11,3.21 12.4,3.21 24.59,3.21 24.59,8.41 IC1.1
  Bottom 0.305: K3.8 29.69,41.96 v29.67,41.95
  Bottom 1.676: K1.P2 K1.1 D2.C 31.19,61.12 | 31.19,61.12 C10.- | 31.19,61.12 28.53,58.45 24.46,58.45 18.24,52.23 v18.24,48.93 18.24,40.68 v14.68,37.12
  pour Bottom (no thermals): 24.59,20.86 27.38,23.66 30.18,23.66 31.19,22.64 31.19,20.99 28.02,17.82 28.15,9.56 26.75,8.16 24.72,8.16
AMP
  Top 0.254: S4.6 8.83,52.22 R33.2
AMP_IN  (via drill 0.3)
  Top 0.254: R35.1 20.91,55.66 23.83,52.74 34.37,52.74 43.26,43.85 62.18,43.85 62.44,43.6 66.12,43.6 v67.9,45.37 | v73.11,32.55 73.11,32.47 IC2.12
  Bottom 0.254: v67.9,45.37 68.15,45.37 68.91,44.61 68.91,36.23 70.56,34.58 71.2,34.58 71.83,33.94 71.83,33.82 v73.11,32.55
CE1N  (via drill 0.3)
  Top 0.254: v83.27,35.47 82.12,34.33 v82.12,33.82 | v73.87,29.25 74.12,28.99 75.16,28.99 IC2.15
  Bottom 0.254: X3.26 80.72,53.79 80.72,39.91 83.27,37.37 v83.27,35.47 | v82.12,33.82 81.23,32.93 78.44,32.93 78.31,33.05 77.68,33.05 v73.87,29.25
GND  (via drill 0.3, 0.6)
  Top 0.254: X3.25 79.44,51.86 83.39,47.91 | 12.27,47.54 13.8,46.01
  other vias: 34.62,19.34 34.62,23.4 33.61,31.79 35.26,31.79 31.58,10.32 34.62,11.08 14.43,17.69 12.91,39.91 22.43,40.42 71.07,72.81 69.93,38.01 84.03,30.52 80.72,29.75 77.42,23.15 79.84,24.17 92.03,24.42 92.54,34.58 65.48,36.23 52.15,39.41 52.15,42.33 83.52,42.07 69.68,60.87 71.58,62.77 61.42,32.42 64.72,33.94 78.06,35.09 75.01,69.76 78.69,66.96 82.38,67.47 38.31,54.26 33.48,59.22 72.34,31.28 69.17,29.12 70.82,21.12 73.49,10.07 84.79,16.16 69.68,1.81 68.28,10.07 70.31,12.1 35.39,46.14 21.92,52.87 23.57,50.71 67.52,50.2 66.63,48.93 76.03,56.8 62.31,56.93 85.68,25.82 87.46,26.32 83.9,43.98 83.77,48.04 85.17,46.39 87.08,42.96
  pour Top (isolate 0.254, rank 6, no thermals): -0.05,0.04 -0.05,74.97 116.92,74.97 116.92,57.06 106.63,57.06 106.63,0.04
  pour Bottom (isolate 0.254, rank 6, no thermals): -0.05,-0.09 -0.05,74.84 116.92,74.84 116.92,56.93 106.63,56.93 106.63,-0.09
MISO  (via drill 0.3)
  Top 0.254: R36.1 v72.98,48.3 R37.1
  Bottom 0.254: X3.21 74.36,49.68 | 74.36,49.68 v72.98,48.3 | D9.C D8.A 79.02,49.68 74.36,49.68
MOSI
  Bottom 0.254: R27.1 71.82,47.03 X3.19
N$1
  Top 1.676: K1.S2 54.05,67.6 51.39,64.93 31.19,64.93 29.92,66.2 C10.+
  Bottom 1.676: S1.4 26.33,68.53 C10.+
N$2  (via drill 0.3)
  Top 0.305: v28.4,51.22 28.4,51.34 28.65,51.6 33.86,51.6 36.53,48.93 v36.53,48.04
  Bottom 0.254: K1.16 D2.A 33.35,69.38 Q2.C
  Bottom 0.305: K1.16 40.72,68.74 42.88,70.9 45.67,70.9 46.43,70.14 46.43,66.96 30.81,51.34 28.53,51.34 v28.4,51.22 | K3.1 37.31,47.26 v36.53,48.04
N$3  (via drill 0.3)
  Top 0.254: IC3.24 69.63,67.22 v69.55,67.22
  Bottom 0.254: v69.55,67.22 69.17,66.84 65.74,66.84 65.1,66.2 65.1,61.88 64.98,61.88 62.06,61.88 60.79,60.61 60.79,57.57 59.64,56.42 57.23,56.42 56.64,55.84 56.64,55.08 X3.8
N$4
  Top 0.254: R7.1 16.21,71.92 D7.C 19.13,69 R8.2 21.16,68.87 R14.1 C24.1
N$5
  pour Bottom (no thermals): 18.75,20.86 23.83,20.86 23.96,7.91 24.34,7.53 27.13,7.53 28.02,8.42 28.91,8.42 29.8,7.53 29.8,4.48 29.42,4.1 22.05,4.1 18.88,7.27
N$6  (via drill 0.3)
  Top 0.254: Q1.1 59,32.04 C15.1 v64.97,31.15 v64.98,31.15 | IC2.7 75.66,36.99 69.17,36.99 67.39,35.21 v67.39,33.56
  Bottom 0.254: v67.39,33.56 v64.98,31.15 | Q5.3 55.37,31.57 Q1.1
N$7
  Top 0.254: IC2.29 89.22,25.69 C8.2
N$8
  Top 0.254: S1.5 10.76,72.03 R7.2
N$9  (via drill 0.3)
  Top 0.254: IC3.25 69.48,65.89 v69.29,66.08
  Bottom 0.254: v69.29,66.08 65.99,66.08 65.74,65.82 65.74,61.63 65.48,61.38 62.31,61.38 61.29,60.36 61.29,57.19 X3.10
N$10  (via drill 0.3)
  Top 0.254: v69.93,32.42 69.93,33.82 71.33,35.21 74.04,35.21 IC2.10 75.56,33.69 76.03,33.69 76.41,34.07 78.57,34.07 v79.07,34.58 | R36.2 77.68,47.16 v78.82,46.01 | v80.98,37.37 79.96,36.36 v79.71,36.36
  Bottom 0.254: v69.93,32.42 67.39,29.88 67.39,29.5 65.1,27.21 R26.2 | v78.82,46.01 78.82,40.04 80.98,37.88 v80.98,37.37 | v79.71,36.36 79.71,35.21 v79.07,34.58
N$11  (via drill 0.3)
  Top 0.254: JP2.1 91.9,2.32 95.08,5.5 95.08,14.77 v94.06,15.78 | v81.11,25.44 81.11,26.58 80.6,27.09 80.04,27.09 IC2.21
  Bottom 0.254: v94.06,15.78 92.28,15.78 83.14,24.93 81.61,24.93 v81.11,25.44
N$12
  Top 0.254: JP2.5 91.52,7.91 90.25,9.18 90.25,15.4 80.98,24.67 80.72,24.67 79.83,25.57 IC2.22
N$13
  Top 0.254: Q2.B 28.65,70.01 27,68.36 27,61.38 29.04,59.34 R5.1
N$14
  Top 0.254: R6.2 82.38,40.03 IC2.44
N$15  (via drill 0.3)
  Top 0.254: JP2.3 92.16,4.86 94.06,6.77 94.06,13.88 v94.19,14.01 | v82.76,24.17 82.76,25.37 IC2.23
  Bottom 0.254: v94.19,14.01 92.92,14.01 v82.76,24.17
N$16  (via drill 0.3)
  Top 0.254: R5.2 34.12,56.55 44.28,46.39 62.18,46.39 62.31,46.52 65.23,46.52 66.37,46.52 v66.5,46.39 | IC2.16 76.43,29.14 75.64,28.36 73.74,28.36 70.56,31.53 68.41,31.53 66.5,33.44 v66.5,37.25
  Bottom 0.254: v66.5,46.39 v66.5,37.25
N$17
  Top 0.254: JP2.9 91.52,17.74 IC2.24
N$18
  Bottom 0.254: IC4.6 73.02,16.03 C11.1
N$19
  Top 0.254: IC3.12 IC3.11
  Top 0.406: R16.1 80.22,70.14 IC3.11
N$20  (via drill 0.3)
  Top 0.254: IC2.2 77.3,41.01 77.3,44.87 76.66,45.5 70.06,45.5 69.42,44.87 69.42,43.85 65.87,40.29 v65.36,40.29 | v65.36,37.63 64.72,36.99 56.09,36.99 55.2,37.88 JP3.1
  Bottom 0.254: v65.36,40.29 v65.36,37.63
N$21
  Top 0.406: R16.2 85.05,70.39 88.22,70.39 88.6,70.77 94.44,70.77 95.08,70.14 103.71,70.14 104.6,69.25 104.6,63.54 104.98,63.15 106.93,63.15 LED1.C
N$22
  Bottom 0.254: R19.1 82.5,12.48 R22.2 82.12,14.51 78.44,14.51 77.93,15.02 73.14,15.02 IC4.7
N$23
  Bottom 0.254: IC4.8 73.64,14.39 77.8,14.39 79.45,12.74 R20.1
N$24  (via drill 0.3)
  Top 0.254: JP1.1 72.85,3.34 v72.47,2.96
  Bottom 0.254: v72.47,2.96 72.35,3.08 R17.2
N$25  (via drill 0.3)
  Top 0.254: v69.17,13.62 65.61,10.07 v65.61,6.64
  Bottom 0.254: IC4.4 69.17,14.44 v69.17,13.62 | v65.61,6.64 R18.2 65.74,4.61 R17.1
N$26  (via drill 0.3)
  Top 0.254: JP1.3 v82.12,8.04
  Bottom 0.254: v82.12,8.04 82.12,9.43 R19.2
N$27  (via drill 0.3)
  Top 0.254: JP1.2 v79.58,8.04
  Bottom 0.254: v79.58,8.04 79.58,9.43 R20.2
N$28
  Bottom 0.254: IC4.30 65.66,17.31 60.53,17.31 59.89,17.95 R21.1
N$29
  Bottom 0.254: IC4.5 73.29,17.43 80.72,17.43 80.98,17.69 R22.1
N$30  (via drill 0.3)
  Top 0.254: v66.12,14.64 63.96,12.48 60.53,12.48 v59.39,13.62
  Bottom 0.254: IC4.27 64.93,14.64 v66.12,14.64 | v59.39,13.62 58.12,13.62 57.61,13.12 56.98,13.12 56.34,12.48 53.17,12.48 | 53.17,12.48 51.33,12.48 Q4.1 | C17.1 53.17,12.48
N$31
  Bottom 0.254: IC4.28 64.16,16.55 55.96,16.55 | 55.96,16.55 53.8,16.55 53.8,18.55 Q4.3 | C16.1 55.96,17.18 55.96,16.55
N$32  (via drill 0.3)
  Top 0.254: v61.29,18.32 61.04,18.07 v61.04,13.37
  Bottom 0.254: R26.1 63.2,18.32 v61.29,18.32 | v61.04,13.37 62.43,11.98 IC4.24
N$33  (via drill 0.3)
  Top 0.254: v61.93,14.13 62.06,14.26 v62.06,19.09
  Bottom 0.254: IC4.25 63.18,14.13 v61.93,14.13 | v62.06,19.09 R25.1
N$34
  Bottom 0.406: IC4.11 IC4.12 72.6,9.24 72.6,8.8 70.44,6.64 67.01,6.64 66.12,7.53 64.98,7.53 62.31,4.86 R23.1
N$35  (via drill 0.3)
  Top 0.406: LED2.C 58.84,6.26 v59.26,6.26
  Bottom 0.406: v59.26,6.26 59.51,6.01 R23.2
N$36  (via drill 0.3)
  Top 0.254: IC2.9 74.54,35.85 70.82,35.85 v70.69,35.72 69.29,34.33 69.29,32.8 v68.79,32.29
  Bottom 0.254: R27.2 70.82,39.48 70.82,35.85 v70.69,35.72 | R25.2 64.47,25.57 64.47,27.85 68.66,32.04 v68.79,32.29
N$37  (via drill 0.3)
  Top 0.305: X3.3 v51.5,49.2 v51.52,49.18
  Bottom 0.305: v51.52,49.18 51.52,44.74 48.72,41.95 45.26,41.95 K3.5
N$38
  Top 0.254: TP14.1 93.42,49.06 95.97,51.6 95.97,53.76 X3.40
N$39  (via drill 0.3)
  Top 0.406: v54.05,50.2 X3.5 54.05,52.52
  Bottom 0.305: v54.05,50.2 48.18,50.2 K3.4
N$40
  Top 0.254: X3.38 96.09,56.42 102.57,56.42 TP13.1
N$41
  Bottom 0.254: TP12.1 91.77,49.56 X3.37
N$42
  Bottom 0.254: TP11.1 101.68,60.87 99.77,58.96 99.77,57.82 98.5,56.55 93.68,56.55 X3.36
N$43
  Bottom 0.254: X3.35 92.16,50.96 90.38,49.18 90.38,46.01 TP10.1
N$44
  Bottom 0.254: TP9.1 88.98,51.85 X3.33
N$45  (via drill 0.3)
  Top 0.254: Q1.2 58.24,27.21 C14.1 60.53,29.5 60.91,29.5 61.93,30.52 64.47,30.52 64.6,30.39 65.61,30.39 v65.74,30.52 | v68.53,33.31 68.53,35.59 69.42,36.48 71.45,36.48 71.58,36.36 75.14,36.36 75.85,35.64 IC2.8
  Bottom 0.254: v65.74,30.52 v68.53,33.31 | Q5.1 49.43,28.05 50.24,28.86 54.18,28.86 Q1.2
N$46
  Top 0.254: TP8.1 98.76,61 96.09,58.33 93.81,58.33 92.16,56.68 88.73,56.68 X3.32
N$47
  Bottom 0.254: X3.31 87.08,49.44 87.46,49.06 87.46,45.76 TP7.1
N$48
  Bottom 0.254: X3.29 85.8,53.76 97.87,53.76 101.3,57.19 TP6.1
N$49  (via drill 0.3)
  Top 0.254: X3.15 66.75,51.72 68.79,49.69 78.82,49.69 79.2,49.31 79.2,48.04 79.07,47.91 79.07,47.15 79.45,46.77 79.71,46.77 80.85,45.63 v83.01,45.63
  Bottom 0.254: TP1.1 85.8,48.42 v83.01,45.63
N$50
  Top 0.254: 15.07,50.84 R31.1 R30.1 C12.1 R32.2
N$51  (via drill 0.3)
  Top 0.254: v62.18,59.73 61.42,60.49 61.42,66.84 55.58,72.68 TP2.1
  Bottom 0.254: X3.16 66.75,55.15 v62.18,59.73
N$52
  Top 0.254: C13.1 R33.1 R35.2 R34.1
N$53  (via drill 0.3)
  Top 0.254: v62.82,60.49 62.18,61.12 62.18,70.9 60.28,72.81 TP3.1
  Bottom 0.254: X3.18 63.83,60.49 v62.82,60.49
N$54
  Top 0.254: X5.3 91.52,62.27 R10.2
N$55
  Top 0.254: X5.2 92.32,60.52 R11.2
N$56
  Top 0.254: IC3.30 71.96,61.88 R12.1
N$57
  Top 0.254: IC3.5 80.32,62.42 R13.1
N$58  (via drill 0.3)
  Top 0.254: C27.1 79.96,72.8 v78.44,72.81 | v76.53,69.38 76.53,67.34 IC3.6
  Bottom 0.254: v78.44,72.81 78.44,71.28 v76.53,69.38
N$59  (via drill 0.3)
  Top 0.254: R10.1 86.06,62.27 85.55,62.77 85.5,62.77 R13.2 83.67,64.4 v81.87,66.2 | v80.47,64.04 80.47,64.53 IC3.7
  Bottom 0.254: v81.87,66.2 81.87,65.44 v80.47,64.04
N$60
  Top 0.254: R11.1 87.17,58.96 IC3.8
N$61
  Top 0.254: X5.1 93.12,63.97 R24.2
N$62
  Top 0.254: IC3.4 80.19,61.42 R9.2 83.59,57.31 92.03,57.31 94.31,59.59 R24.1
N$63
  Top 0.254: IC3.27 70.86,64.17 69.29,64.17 69.17,64.3 69.17,65.31 65.82,68.66 Q3.1 65.74,68.71 C29.1
N$64
  Top 0.254: C28.1 68.08,61.69 68.08,63.66 | 68.08,63.66 Q3.3 | IC3.28 71.48,63.66 68.08,63.66
N$65
  Bottom 0.254: X3.22 75.14,55.03 77.3,57.19 97.11,57.19 TP4.1
N$66
  Top 0.254: TP5.1 53.04,48.04 54.82,49.82 54.82,50.71 X3.7
PI_ACTIVE
  Top 0.254: IC2.43 85.17,41.26 85.17,44.23 79.2,50.2 69.04,50.2 68.03,51.22 68.03,53.12 67.39,53.76 62.06,53.76 61.66,54.15 X3.12
PI_READY  (via drill 0.3)
  Top 0.254: IC2.32 87.47,30.88 v85.93,32.42
  Bottom 0.254: v85.93,32.42 84.44,32.42 81.61,35.25 81.61,35.59 79.96,37.25 79.58,37.25 X3.13
PI_SHDN  (via drill 0.3)
  Top 0.254: X3.11 61.67,52.53 R38.1 R39.1 59.16,47.56 v59.13,47.53
  Bottom 0.254: D3.C 59.01,47.09 | 59.01,47.09 D4.A | v59.13,47.53 59.13,47.21 59.01,47.09
PI_SHUTDOWN  (via drill 0.3)
  Top 0.254: IC2.41 85.17,39 v85.17,39.66 | v81.74,46.39 80.85,46.39 v79.71,47.53 | v73.11,47.02 72.85,46.77 67.64,46.77 65.23,49.18 R38.2
  Bottom 0.254: v85.17,39.66 85.17,42.96 83.52,42.96 81.74,44.74 v81.74,46.39 | v79.71,47.53 73.61,47.53 v73.11,47.02
RESET  (via drill 0.3)
  Top 0.254: IC2.4 75.9,40.14 75.9,42.33 74.75,43.47 R15.1 C6.1 66.5,38.26 65.87,38.26 65.74,38.39 64.98,38.39 64.85,38.26 JP3.5 | JP2.6 87.71,8.67 87.71,14.89 77.42,25.18 74.25,25.18 73.87,25.18 72.72,26.32 72.72,26.83 69.55,30.01 67.39,30.01 65.36,32.04 63.58,32.04 62.82,32.8 62.82,33.69 v61.93,34.58
  Bottom 0.254: v61.93,34.58 61.93,36.61 JP3.5
SCK
  Top 0.254: X3.23 76.9,51.36 77.42,50.84 79.58,50.84 86.06,44.36 86.06,38.76 IC2.40
SCL_3  (via drill 0.3)
  Top 0.254: R2.2 29.42,50.2 28.02,48.8 28.02,46.9 28.78,46.14 U$3.3
  Top 0.305: R2.2 33.48,50.2 v33.73,49.95
  Bottom 0.305: v33.73,49.95 39.83,49.95 40.85,48.93 K3.2 K3.3
SCL_5
  Top 0.254: S4.4 6.05,46.14 6.81,46.9 8.33,46.9 10.24,48.8 16.84,48.8 R3.2 20.27,48.42 23.45,48.42 24.13,47.74 U$3.5 U$3.6 25.1,46.14 25.86,45.37 25.86,42.83 27.89,40.8 49.1,40.8 53.67,36.23 62.95,36.23 63.83,35.34 63.83,33.56 64.34,33.05 66.12,33.05 68.15,31.02 70.06,31.02 73.74,27.34 73.74,27.09 74.25,26.58 77.27,26.58 IC2.19
SDA_3  (via drill 0.3)
  Top 0.254: U$3.1 30.68,43.6 R1.2
  Top 0.305: R1.2 34.37,42.07 38.81,42.07 41.99,42.07 v41.99,41.95
  Bottom 0.305: K3.6 43.03,41.95 v41.99,41.95 41.97,41.96 K3.7
SDA_5
  Top 0.254: S4.3 6.58,41.72 8.72,43.85 8.72,46.52 10.37,48.17 16.08,48.17 17.35,46.9 17.35,44.74 R4.2 20.52,41.56 24.08,41.56 24.13,41.62 | U$3.7 U$3.8 24.13,41.62 | 24.13,41.62 26.19,41.62 27.77,40.04 48.85,40.04 53.29,35.59 62.69,35.59 63.33,34.96 63.33,33.05 63.83,32.55 65.74,32.55 67.77,30.52 69.8,30.52 73.23,27.09 73.23,26.71 73.99,25.94 74.12,25.94 77.77,25.94 IC2.20
TASTE_DREHGEBER_L
  Top 0.254: X1.1 95.71,27.47 88.58,27.47 IC2.30
TASTE_DREHGEBER_R
  Top 0.254: IC2.31 89.07,28.1 97.62,28.1 X1.2
TASTE_FAHNE  (via drill 0.3)
  Top 0.254: IC2.14 76.57,31.53 v78.57,31.53
  Bottom 0.254: v78.57,31.53 86.31,31.53 89.36,34.58 89.36,34.96 96.22,41.82 96.22,42.58 96.85,43.22 99.01,43.22 X2.2
TASTE_INFO  (via drill 0.3)
  Top 0.254: v82.38,28.1 82.38,28.01 IC2.25
  Bottom 0.254: X2.3 97.11,41.95 90,34.83 90,33.94 84.03,27.98 82.5,27.98 v82.38,28.1
TASTE_NAVI
  Top 0.254: X1.4 99.01,21.62 88.6,21.62 84.92,25.31 84.92,26.58 IC2.26
TASTE_VERKEHR  (via drill 0.3)
  Top 0.254: IC2.13 74.82,30.84 76.03,32.04 77.68,32.04 v77.93,32.29
  Bottom 0.254: v77.93,32.29 77.93,32.17 77.3,31.53 77.3,31.15 81.49,26.96 83.01,26.96 91.14,18.83 98.76,18.83 X1.6
TASTEN_A
  Top 0.254: IC2.37 88.22,37.52 88.22,42.07 89.36,43.22 90.25,43.22 | R28.1 R28.2 | R28.2 99.01,43.22 X2.4
  Top 0.406: R28.2 | R28.1 90.25,43.22
TASTEN_B
  Top 0.254: X2.5 R29.2 | R29.2 R29.1 | R29.1 87.71,36.1 87.71,35.85 86.94,35.08 IC2.36 | R29.1
  Top 0.406: R29.2
TASTEN_C
  Top 0.254: IC2.35 89.31,36.36 R40.1 | R40.1 R40.2 | R40.2 96.73,36.36 98.25,38.13 99.52,39.41 X2.6
  Top 0.406: R40.2 | R40.1
TASTEN_D  (via drill 0.3)
  Top 0.254: X1.5 v94.19,20.36 | v94.06,30.13 91.85,30.13 IC2.34
  Bottom 0.254: v94.19,20.36 94.19,22.89 | R41.2 94.19,25.69 | R41.1 94.19,30.01 v94.06,30.13
  Bottom 0.406: R41.1 94.19,25.69 | R41.2 94.19,22.89
TASTEN_E
  Top 0.254: X1.3 99.01,24.17 101.05,24.17 102.06,25.18 102.06,31.4 101.05,32.42 100.03,32.42 | R42.2 R42.1 | 96.98,32.42 95.97,32.42 95.33,31.79 95.33,29.75 94.31,28.74 90.7,28.74 IC2.33
  Top 0.406: R42.1 96.98,32.42 | R42.2 100.03,32.42
ZV_AUF
  Top 0.254: S4.5 7.87,48.72 R30.2
ZV_AUF_IN  (via drill 0.3)
  Top 0.254: R32.1 21.67,50.58 23.19,52.11 34.12,52.11 43.01,43.22 62.06,43.22 62.31,42.96 66.37,42.96 67.64,44.23 v67.77,44.23 | IC2.11 74.18,34.02 73.49,34.71 71.83,34.71 v70.95,33.82
  Bottom 0.254: v70.95,33.82 70.44,33.82 67.64,36.61 67.64,44.1 v67.77,44.23

### Text on the board
Top: L | R | RPiAVR / interface